# EasyEDA Pro project ProPrj_农装B类小车V2_2025-10-25.epro, board PCB7_1
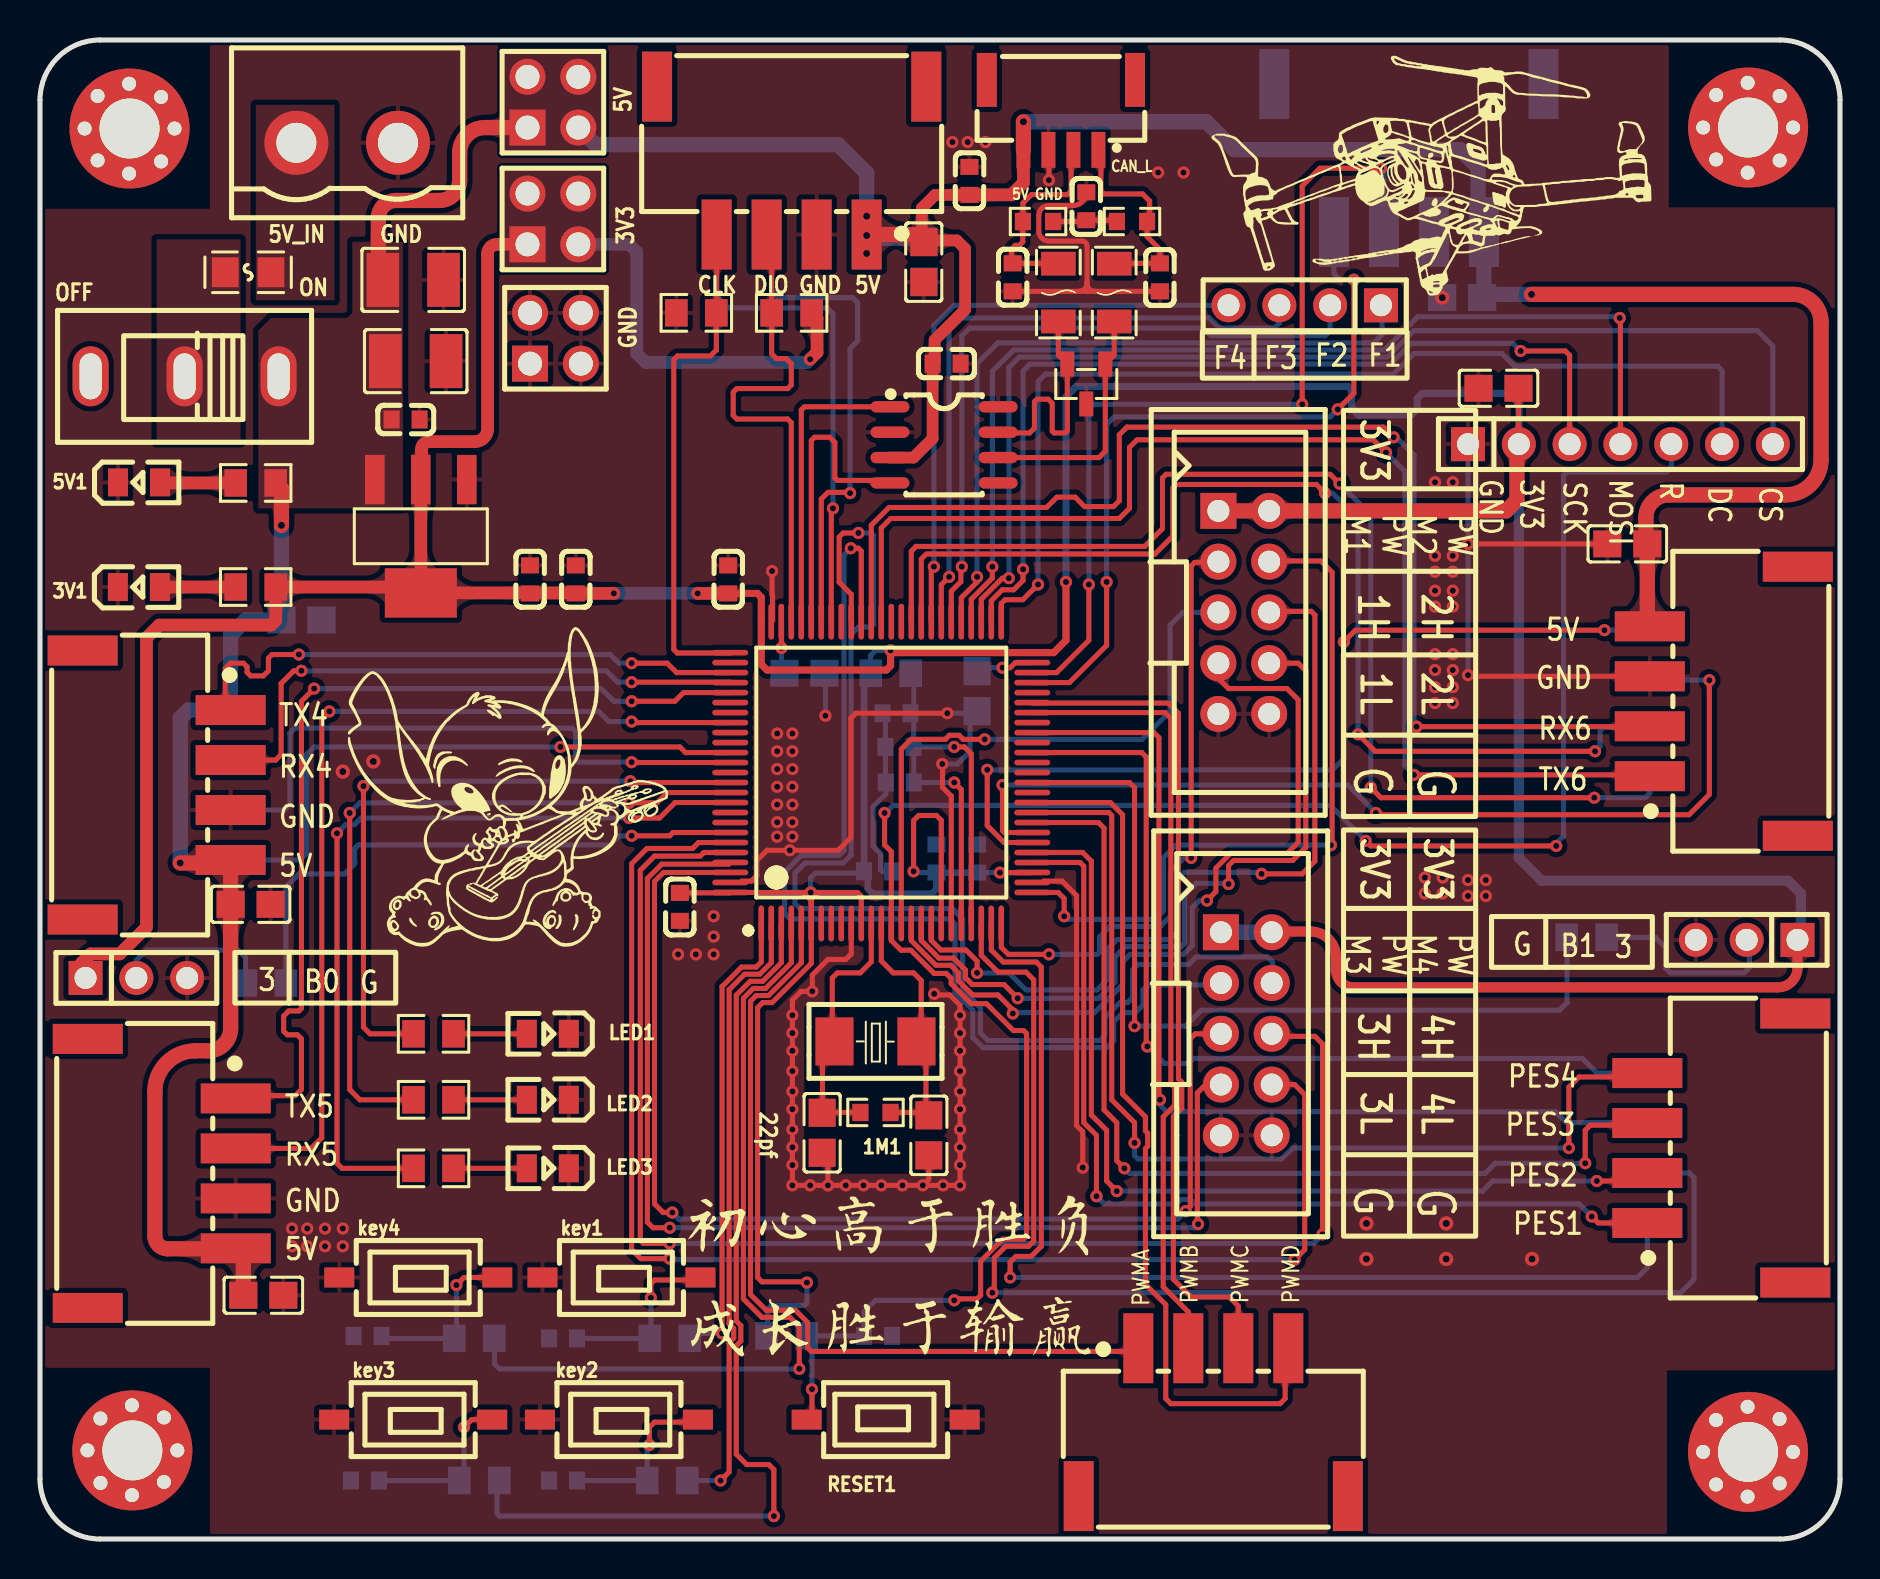
[diagram p8: board, top side]
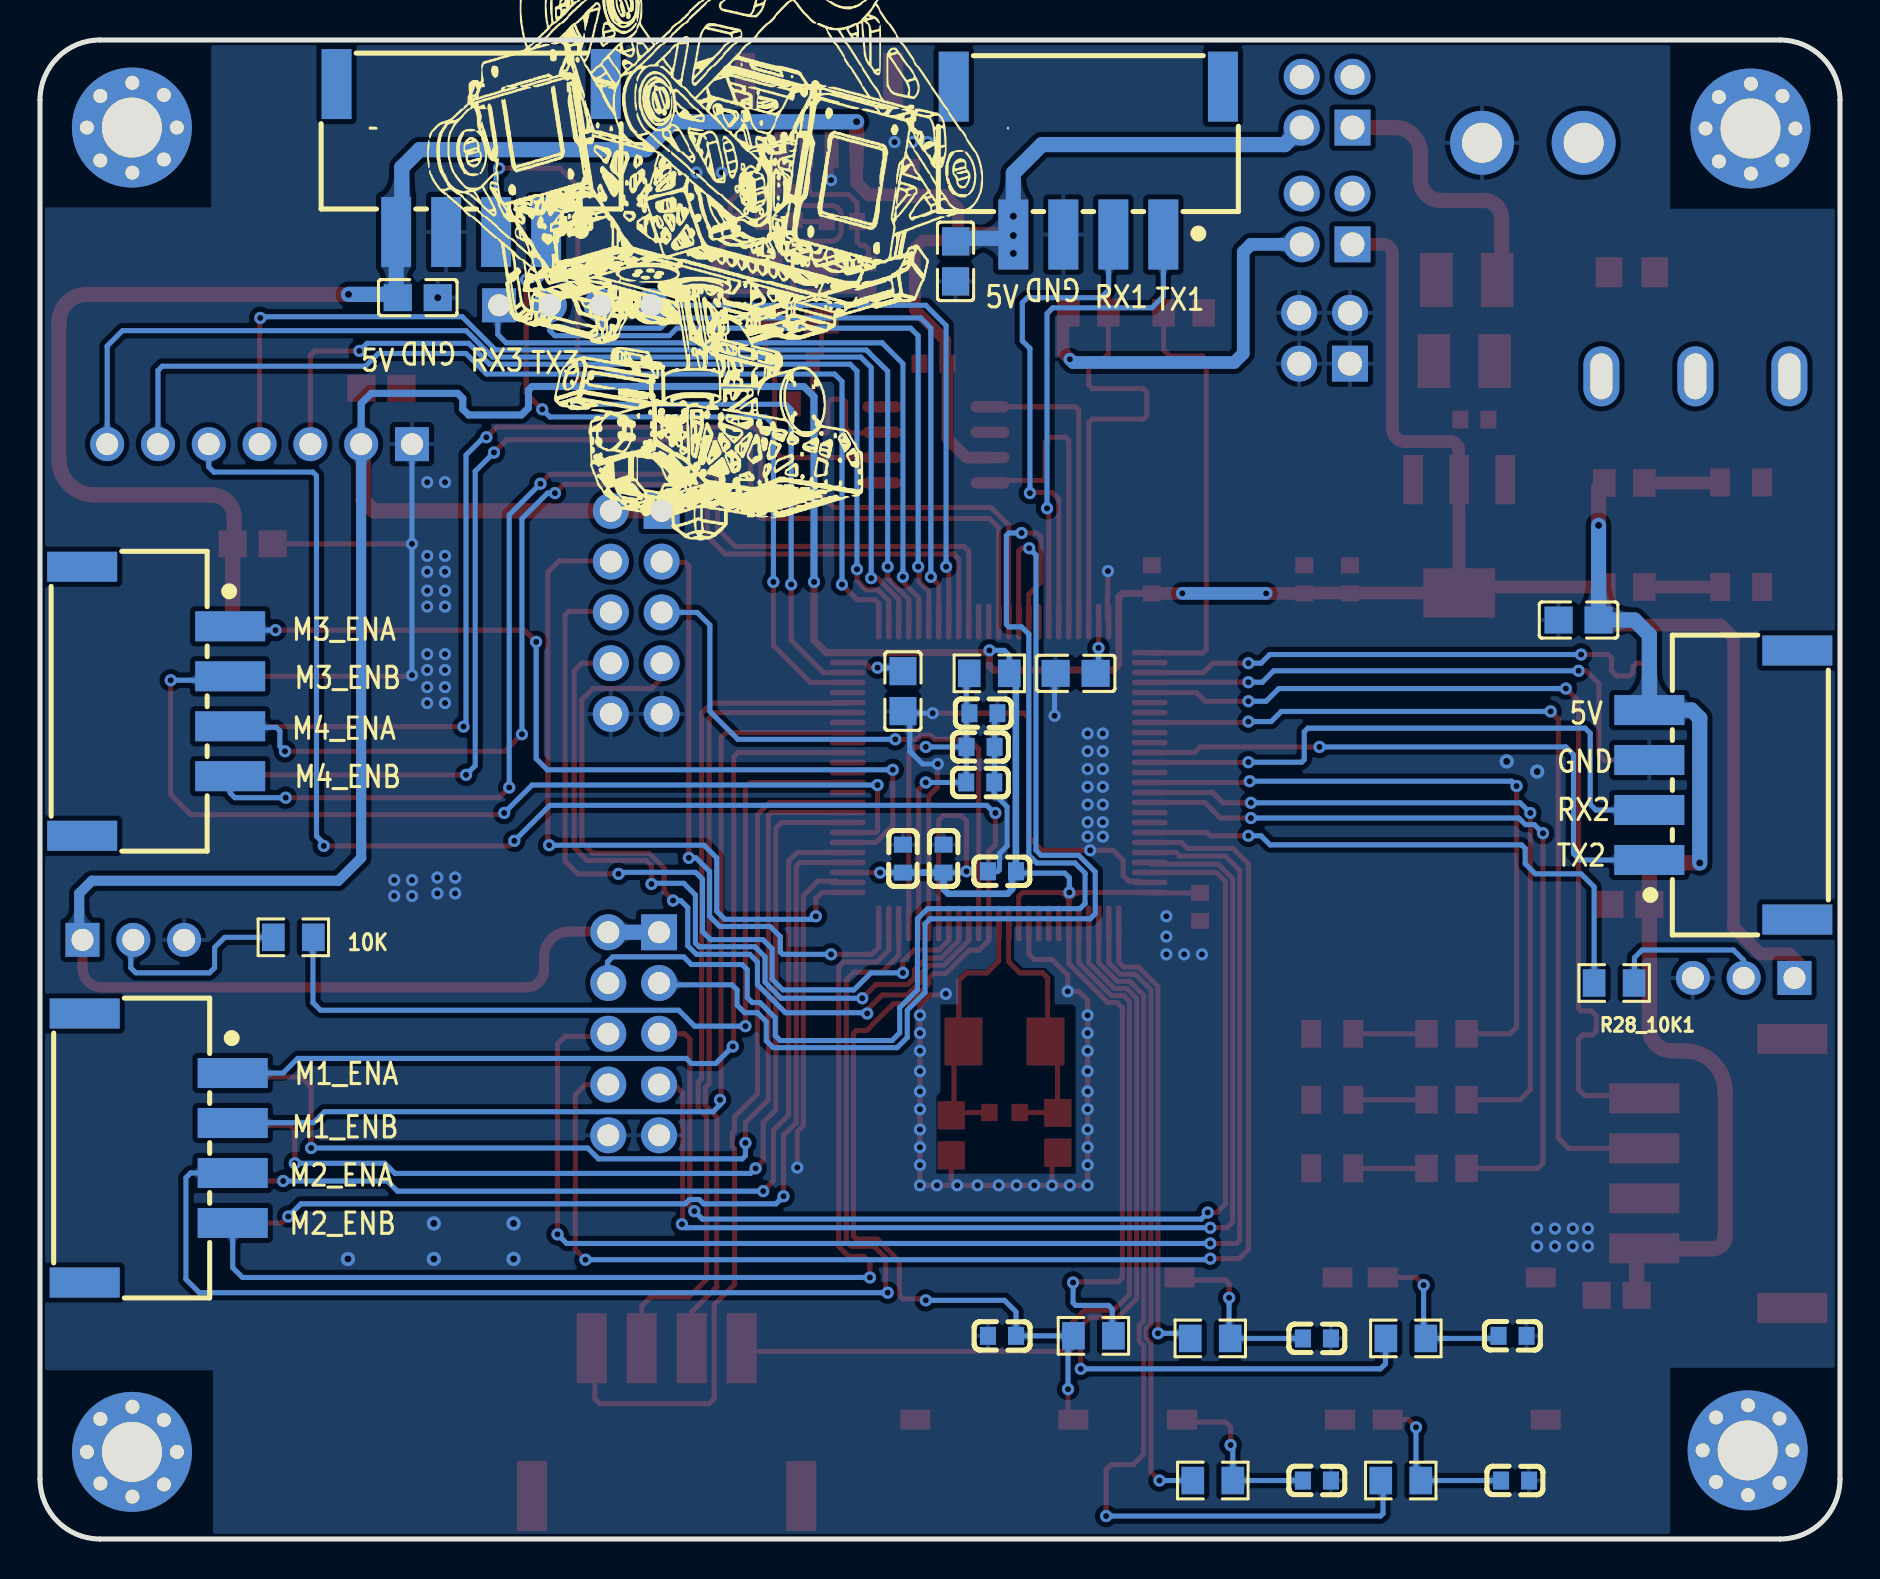
[diagram p9: board, bottom side, seen from below]

Outline 90 x 75 mm; copper layers: Top Layer, Bottom Layer. Coordinates in mm from the lower left corner of the outline.
Outline path: 0,72 arc(0.88,74.12) 3,75 87,75 arc(89.12,74.12) 90,72 90,3 arc(89.12,0.88) 87,0 3,0 arc(0.88,0.88) 0,3 0,72
Stack: Top Layer 0.035mm / Dielectric1 1.51mm FR4 er 4.5 / Bottom Layer 0.035mm

## Design rules (mm)
net OSC_OUT: DP1
net OSC_IN: DP1
net CAN1_L: DP4
net CAN1_H: DP4
net USART2_TX: DP7
net USART2_RX: DP7
net USART1_TX: DP6
net USART1_RX: DP6
net USART4_TX: DP8
net USART4_RX: DP8
net SWDIO: DP3
net SWCLK: DP3
net USART5_TX: DP9
net USART5_RX: DP9
net USART6_TX: DP10
net USART6_RX: DP10
net $1N59236: DP5
net $1N59237: DP5
net CAN1_RX: DP2
net CAN1_TX: DP2
template: 自定义配置
spacing copperThickness1oz (default): track to track 0.102, other pairs 0.152 to 0.3
spacing copperThickness2oz: track to track 0.203, other pairs 0.152 to 0.3
track width copperThickness1oz (default): min 0.127, default 0.254, max 2.54
track width copperThickness2oz: min 0.203, default 0.254, max 2.54
differential pair differentialPair (default): width min 0.127, default 0.254, max 2.54; gap min 0.152, default 0.152
via viaSize (default): diameter min 0.5, default 0.61, max 10; hole min 0.3, default 0.305, max 6.299
net $1N12322 uses copperRegion1

## Placement (name value [footprint] x y rotation side)
1M1  SCR0603J1K  [R0603]  41.77 21.34 0 top
3V1  NCD0805R1  [LED0805-R-RD]  4.94 47.63 0 top
5V1  NCD0805R1  [LED0805-R-RD]  4.95 52.86 0 top
C1  104  [C0603]  26.15 10.04 180 bottom
C1_22pf1  22pf  [C0805]  44.44 20.2 90 top
C2_22pf1  100nF  [C0805]  39.11 20.32 90 top
C5  104  [C0603]  46.85 34.04 270 bottom
C6  104  [C0603]  44.82 34.04 270 bottom
C7  104  [C0603]  32 31.63 90 top
C8  104  [C0603]  34.41 48.01 270 top
C9  104  [C0603]  41.9 33.41 180 bottom
C10  106  [C0603]  26.79 48.01 270 top
C22  104  [C0603]  45.33 58.81 0 top
C24  104  [C0805]  44.22 63.92 90 bottom
C25  104  [C0805]  72.93 57.57 0 top
C26  22p  [C0603]  56 63.12 90 top
C27  22p  [C0603]  52.31 66.68 90 top
C33_2.2uf1  100nF  [C0603]  42.99 37.85 0 bottom
C34_106  106  [C0603]  42.97 39.63 180 bottom
C35_104  104  [C0603]  42.83 41.32 180 bottom
C39  104  [C0603]  41.9 10.16 0 bottom
C40  104  [C0805]  44.19 63.89 270 top
C41  104  [C0805]  13.07 45.98 180 bottom
C42  104  [C0805]  71.11 62.11 0 bottom
C43  104  [C0805]  10.53 31.75 180 top
C44  2.2uf  [C0805]  46.85 42.42 270 bottom
C45  2.2uf  [C0805]  38.22 43.31 0 bottom
C52  104  [C0603]  18.28 56.01 180 top
C53  104  [C0603]  24.5 48.01 270 top
C54  100uF  [C1210]  18.66 63 0 top
C55  100uF  [C1210]  18.79 58.93 0 top
C56  104  [C0603]  26.15 2.93 180 bottom
C57  104  [C0603]  16.25 2.93 180 bottom
C58  104  [C0603]  16.37 10.16 180 bottom
C61  104  [C0805]  11.17 12.2 180 top
C63  104  [C0805]  79.37 49.79 0 top
C64  22p  [C0603]  48.63 63.12 270 top
C65  104  [C0603]  46.47 67.95 270 top
CN2  WAFER-XH2.54-4PWB  [CONN-TH_4P-P0.20_XUNPU_WAFER-XH2.54-4PWB]  5.83 37.72 90 bottom
CN3  WAFER-XH2.54-4PWB  [CONN-TH_4P-P0.20_XUNPU_WAFER-XH2.54-4PWB]  37.58 68.97 0 bottom
CN4  WAFER-XH2.54-4PWB  [CONN-TH_4P-P0.20_XUNPU_WAFER-XH2.54-4PWB]  68.44 69.09 0 bottom
CN5  WAFER-XH2.54-4PWB  [CONN-TH_4P-P0.20_XUNPU_WAFER-XH2.54-4PWB]  5.83 37.72 270 top
CN6  WAFER-XH2.54-4PWB  [CONN-TH_4P-P0.20_XUNPU_WAFER-XH2.54-4PWB]  37.58 68.97 180 top
CN15  WAFER-XH2.54-4PWB  [CONN-TH_4P-P0.20_XUNPU_WAFER-XH2.54-4PWB]  84.06 19.56 90 top
CN16  WAFER-XH2.54-4PWB  [CONN-TH_4P-P0.20_XUNPU_WAFER-XH2.54-4PWB]  58.66 5.85 0 top
CN24  DB2EVC-5.08-2P-GN  [CONN-TH_2P-P5.08_DB2EVC-5.08-2P]  15.36 69.85 180 top
CN25  WAFER-XH2.54-4PWB  [CONN-TH_4P-P0.20_XUNPU_WAFER-XH2.54-4PWB]  6.09 18.29 270 top
CN26  BH254V-10P  [IDC-TH_10P-P2.54-V-R2-C5-S2.54]  60.19 46.36 270 top
CN28  BH254V-10P  [IDC-TH_10P-P2.54-V-R2-C5-S2.54]  60.32 25.28 270 top
CN29  WAFER-XH2.54-4PWB  [CONN-TH_4P-P0.20_XUNPU_WAFER-XH2.54-4PWB]  84.19 41.91 90 top
CN30  WAFER-XH2.54-4PWB  [CONN-TH_4P-P0.20_XUNPU_WAFER-XH2.54-4PWB]  84.06 19.56 270 bottom
CN31  WAFER-XH2.54-4PWB  [CONN-TH_4P-P0.20_XUNPU_WAFER-XH2.54-4PWB]  84.19 41.91 270 bottom
CN32  GH125-S04DCA-00  [CONN-SMD_4P-P1.27_GH125-S04DCA-00]  51.05 71.25 180 top
D1  NUP2105LT1G-TP  [SOT-23-3_L2.9-W1.3-P1.90-LS2.4-BR]  52.31 57.79 90 top
F1  BSMD0805-100-6V  [F0805]  10.41 63.38 0 top
F3  nSMD020-30V  [F1206]  53.71 62.36 90 top
F4  nSMD020-30V  [F1206]  50.92 62.36 90 top
H7  H3  [HDR-TH_3P-P2.54-V-M]  4.82 28.07 0 top
H8  H3  [HDR-TH_3P-P2.54-V-M]  85.34 29.98 180 top
H25  PZ254V-11-07P  [HDR-TH_7P-P2.54-V-M]  79.02 54.78 0 top
H26  A2541WV-2x2P  [HDR-TH_4P-P2.54-V-R2-C2-S2.54_A2541WV-2X2P]  25.77 60.08 0 top
H27  A2541WV-2x2P  [HDR-TH_4P-P2.54-V-R2-C2-S2.54_A2541WV-2X2P]  25.64 71.89 0 top
H28  A2541WV-2x2P  [HDR-TH_4P-P2.54-V-R2-C2-S2.54_A2541WV-2X2P]  25.64 66.04 0 top
H29  PZ254V-11-04P  [HDR-TH_4P-P2.54-V-M]  63.24 61.73 180 top
key1  TS-1092S-B3D2-G  [SW-SMD_L6.1-W3.6-LS7.9]  29.07 13.09 180 top
key2  TS-1092S-B3D2-G  [SW-SMD_L6.1-W3.6-LS7.9]  28.95 5.97 180 top
key3  TS-1092S-B3D2-G  [SW-SMD_L6.1-W3.6-LS7.9]  18.66 5.97 180 top
key4  TS-1092S-B3D2-G  [SW-SMD_L6.1-W3.6-LS7.9]  18.91 13.09 180 top
LED1  NCD0805R1  [LED0805-R-RD]  25.39 25.28 180 top
LED2  NCD0805R1  [LED0805-R-RD]  25.39 21.98 180 top
LED3  NCD0805R1  [LED0805-R-RD]  25.39 18.55 180 top
NOREF  -  [Pad_e4697]  6.06 72.15 180 top
NOREF#2  -  [Pad_e4710]  85.38 72.86 0 top
NOREF#3  -  [Pad_e111]  6.2 6.08 0 top
NOREF#4  -  [Pad_e4713]  86.98 68.97 180 top
NOREF#5  -  [Pad_e4703]  6.06 68.92 180 top
NOREF#6  -  [Pad_e4705]  4.48 70.57 0 top
NOREF#7  -  [Pad_e108]  4.6 2.2 180 top
NOREF#8  -  [Pad_e105]  3.02 6.03 0 top
NOREF#9  -  [Pad_e104]  4.6 6.69 180 top
NOREF#10  -  [Pad_e109]  6.2 2.86 0 top
NOREF#11  -  [Pad_e4723]  86.98 2.78 0 top
NOREF#12  -  [Pad_e4712]  87.66 70.62 270 top
NOREF#13  -  [Pad_e4702]  4.45 68.31 0 top
NOREF#14  -  [Pad_e4717]  83.81 72.25 180 top
NOREF#15  -  [Pad_e4724]  85.38 2.12 180 top
NOREF#16  -  [Pad_e4715]  83.81 69.02 180 top
NOREF#17  -  [Pad_e4704]  6.73 70.57 270 top
NOREF#18  -  [Pad_e4701]  2.23 70.57 270 top
NOREF#19  -  [Pad_e110]  6.87 4.44 270 top
NOREF#20  -  [Pad_e4718]  85.41 70.62 0 top
NOREF#21  -  [Pad_e112]  4.62 4.44 180 top
NOREF#22  -  [Pad_e4725]  83.81 2.73 0 top
NOREF#23  -  [Pad_e107]  3.02 2.81 0 top
NOREF#24  -  [Pad_e4700]  2.88 68.97 180 top
NOREF#25  -  [Pad_e4726]  83.16 4.36 270 top
NOREF#26  -  [Pad_e4728]  85.38 6.62 180 top
NOREF#27  -  [Pad_e4714]  85.38 68.36 0 top
NOREF#28  -  [Pad_e4722]  87.65 4.36 270 top
NOREF#29  -  [Pad_e4698]  4.45 72.81 0 top
NOREF#30  -  [Pad_e4721]  86.98 6.01 0 top
NOREF#31  -  [Pad_e106]  2.37 4.44 270 top
NOREF#32  -  [Pad_e4727]  83.81 5.96 0 top
NOREF#33  -  [Pad_e4716]  83.16 70.62 270 top
NOREF#34  -  [Pad_e4711]  86.98 72.2 180 top
NOREF#35  -  [Pad_e4699]  2.88 72.2 180 top
NOREF#36  -  [Pad_e4729]  85.4 4.36 180 top
R6_1k1  1K  [R0805]  31.49 10.04 180 bottom
R7_1K1  1K  [R0805]  31.36 2.93 180 bottom
R8_1K1  1K  [R0805]  21.96 2.93 180 bottom
R10_2K1  2K  [R0805]  19.68 21.98 0 top
R10_2K2  2K  [R0805]  19.68 18.55 0 top
R10_10K1  10K  [R0805]  10.79 47.63 180 top
R10_10K2  10K  [R0805]  37.58 61.35 180 top
R10_10K3  10K  [R0805]  32.82 61.35 0 top
R13_2K1  2K  [R0805]  19.68 25.28 0 top
R13_10K1  10K  [R0805]  10.79 52.84 180 top
R19  60R4  [R0603]  49.9 65.92 180 top
R20  60R4  [R0603]  54.6 65.92 180 top
R27_0Ω1  0K  [R0805]  42.54 43.31 0 bottom
R28_10K1  10K  [R0805]  11.29 27.82 180 bottom
R29_10K1  10K  [R0805]  77.33 30.1 0 bottom
R30  10K  [R0805]  37.33 10.16 0 bottom
R31_1K1  1K  [R0805]  21.71 10.04 180 bottom
RESET1  TS-1092S-B3D2-G  [SW-SMD_L6.1-W3.6-LS7.9]  42.28 5.97 0 top
U3  单刀双掷  [SW-TH_SS-12D10-G050]  7.23 58.17 180 top
U4  -  [407vgt6]  43.68 39.88 45 top
U10  SK12D07VG3  [SOT-223-4_L6.5-W3.5-P2.30-LS7.0-BR]  19.04 50.17 90 top
U13  TJA1050T/CM,118  [SOIC-8_L5.0-W4.0-P1.27-LS6.0-BL]  45.2 54.74 270 top
X1  8MHz  [CRYSTAL-SMD_L5.0-W3.2]  41.77 24.9 0 top

## Footprints (pads in the part's own frame, mm; a bottom-side part is the same pattern mirrored in y, then rotated)
407vgt6
  oval 0.28x1.796 smd rot 135: 1(-11.809,-1.04) 2(-11.456,-1.393) 3(-11.101,-1.747) 4(-10.748,-2.1) 5(-10.394,-2.454) 6(-10.041,-2.808) 7(-9.687,-3.161) 8(-9.334,-3.514) 9(-8.98,-3.868) 10(-8.627,-4.221) 11(-8.273,-4.575) 12(-7.92,-4.929) 13(-7.566,-5.282) 14(-7.213,-5.636) 15(-6.859,-5.989) 16(-6.505,-6.343) 17(-6.152,-6.697) 18(-5.798,-7.05) 19(-5.445,-7.404) 20(-5.091,-7.757) 21(-4.737,-8.111) 22(-4.384,-8.464) 23(-4.03,-8.818) 24(-3.677,-9.171) 25(-3.323,-9.525) 51(7.354,1.152) 52(7,1.506) 53(6.646,1.859) 54(6.293,2.213) 55(5.939,2.567) 56(5.586,2.92) 57(5.232,3.273) 58(4.879,3.627) 59(4.525,3.981) 60(4.172,4.334) 61(3.818,4.688) 62(3.465,5.041) 63(3.111,5.395) 64(2.757,5.748) 65(2.404,6.102) 66(2.05,6.455) 67(1.697,6.809) 68(1.343,7.162) 69(0.99,7.516) 70(0.636,7.87) 71(0.282,8.223) 72(-0.071,8.577) 73(-0.424,8.931) 74(-0.778,9.284) 75(-1.131,9.637)
  oval 1.796x0.28 smd rot 135: 26(-1.131,-9.525) 27(-0.778,-9.171) 28(-0.424,-8.818) 29(-0.071,-8.464) 30(0.282,-8.111) 31(0.636,-7.758) 32(0.99,-7.404) 33(1.343,-7.05) 34(1.697,-6.697) 35(2.05,-6.343) 36(2.404,-5.989) 37(2.757,-5.636) 38(3.111,-5.282) 39(3.465,-4.928) 40(3.818,-4.575) 41(4.172,-4.221) 42(4.525,-3.868) 43(4.879,-3.514) 44(5.232,-3.161) 45(5.586,-2.808) 46(5.939,-2.454) 47(6.293,-2.1) 48(6.646,-1.747) 49(7,-1.393) 50(7.354,-1.04) 76(-3.324,9.637) 77(-3.677,9.284) 78(-4.03,8.931) 79(-4.384,8.577) 80(-4.737,8.223) 81(-5.091,7.87) 82(-5.445,7.516) 83(-5.798,7.162) 84(-6.152,6.809) 85(-6.505,6.455) 86(-6.859,6.102) 87(-7.213,5.748) 88(-7.566,5.395) 89(-7.92,5.042) 90(-8.273,4.688) 91(-8.627,4.334) 92(-8.98,3.981) 93(-9.334,3.627) 94(-9.688,3.273) 95(-10.041,2.92) 96(-10.395,2.567) 97(-10.748,2.213) 98(-11.101,1.859) 99(-11.456,1.506) 100(-11.809,1.152)
C0603
  rect 0.8x0.9 smd: 1(-0.7,0) 2(0.7,0)
C0805
  rect 1.41x1.35 smd: 1(-1,0) 2(1,0)
C1210
  rect 1.635x2.7 smd: 1(-1.518,0) 2(1.518,0)
CONN-SMD_4P-P1.27_GH125-S04DCA-00
  rect 0.7x1.8 smd: 1(-1.875,1.75) 2(-0.625,1.75) 3(0.625,1.75) 4(1.875,1.75)
  rect 1x2.7 smd: 5(3.705,-1.75) 6(-3.705,-1.75)
CONN-TH_2P-P5.08_DB2EVC-5.08-2P
  round 3.2 hole 2: 1(-2.54,0) 2(2.54,0)
CONN-TH_4P-P0.20_XUNPU_WAFER-XH2.54-4PWB
  rect 1.5x3.5 smd: 1(-3.75,3.7) 2(-1.25,3.7) 3(1.25,3.7) 4(3.75,3.7) 5(-6.73,-3.7) 6(6.73,-3.7)
CRYSTAL-SMD_L5.0-W3.2
  rect 1.9x2.401 smd: 1(-2.05,0) 2(2.05,0)
F0805
  rect 1.335x1.5 smd: 1(-1.143,0) 2(1.143,0)
F1206
  rect 1.19x1.728 smd: 1(-1.445,0) 2(1.445,0)
HDR-TH_3P-P2.54-V-M
  rect 1.7x1.7 hole 1.1: 1(-2.54,0)
  round 1.7 hole 1.1: 2(0,0) 3(2.54,0)
HDR-TH_4P-P2.54-V-M
  rect 1.7x1.7 hole 1.1: 1(-3.81,0)
  round 1.7 hole 1.1: 2(-1.27,0) 3(1.27,0) 4(3.81,0)
HDR-TH_4P-P2.54-V-R2-C2-S2.54_A2541WV-2X2P
  rect 1.8x1.8 hole 1.2: 1(-1.27,-1.27)
  round 1.8 hole 1.2: 2(-1.27,1.27) 3(1.27,-1.27) 4(1.27,1.27)
HDR-TH_7P-P2.54-V-M
  rect 1.7x1.7 hole 1.1: 1(-7.62,0)
  round 1.7 hole 1.1: 2(-5.08,0) 3(-2.54,0) 4(0,0) 5(2.54,0) 6(5.08,0) 7(7.62,0)
IDC-TH_10P-P2.54-V-R2-C5-S2.54
  rect 1.8x1.8 hole 1.1: 1(-5.08,-1.27)
  round 1.8 hole 1.1: 2(-5.08,1.27) 3(-2.54,-1.27) 4(-2.54,1.27) 5(0,-1.27) 6(0,1.27) 7(2.54,-1.27) 8(2.54,1.27) 9(5.08,-1.27) 10(5.08,1.27)
LED0805-R-RD
  rect 1x1.399 smd: 1(1.05,0) 2(-1.05,0)
Pad_e104
  round 1.2 hole 0.7: 1(0,0)
Pad_e105
  round 1.2 hole 0.7: 1(0,0)
Pad_e106
  round 1.2 hole 0.7: 1(0,0)
Pad_e107
  round 1.2 hole 0.7: 1(0,0)
Pad_e108
  round 1.2 hole 0.7: 1(0,0)
Pad_e109
  round 1.2 hole 0.7: 1(0,0)
Pad_e110
  round 1.2 hole 0.7: 1(0,0)
Pad_e111
  round 1.2 hole 0.7: 1(0,0)
Pad_e112
  round 6 hole 3: 1(0,0)
Pad_e4697
  round 1.2 hole 0.7: 1(0,0)
Pad_e4698
  round 1.2 hole 0.7: 1(0,0)
Pad_e4699
  round 1.2 hole 0.7: 1(0,0)
Pad_e4700
  round 1.2 hole 0.7: 1(0,0)
Pad_e4701
  round 1.2 hole 0.7: 1(0,0)
Pad_e4702
  round 1.2 hole 0.7: 1(0,0)
Pad_e4703
  round 1.2 hole 0.7: 1(0,0)
Pad_e4704
  round 1.2 hole 0.7: 1(0,0)
Pad_e4705
  round 6 hole 3: 1(0,0)
Pad_e4710
  round 1.2 hole 0.7: 1(0,0)
Pad_e4711
  round 1.2 hole 0.7: 1(0,0)
Pad_e4712
  round 1.2 hole 0.7: 1(0,0)
Pad_e4713
  round 1.2 hole 0.7: 1(0,0)
Pad_e4714
  round 1.2 hole 0.7: 1(0,0)
Pad_e4715
  round 1.2 hole 0.7: 1(0,0)
Pad_e4716
  round 1.2 hole 0.7: 1(0,0)
Pad_e4717
  round 1.2 hole 0.7: 1(0,0)
Pad_e4718
  round 6 hole 3: 1(0,0)
Pad_e4721
  round 1.2 hole 0.7: 1(0,0)
Pad_e4722
  round 1.2 hole 0.7: 1(0,0)
Pad_e4723
  round 1.2 hole 0.7: 1(0,0)
Pad_e4724
  round 1.2 hole 0.7: 1(0,0)
Pad_e4725
  round 1.2 hole 0.7: 1(0,0)
Pad_e4726
  round 1.2 hole 0.7: 1(0,0)
Pad_e4727
  round 1.2 hole 0.7: 1(0,0)
Pad_e4728
  round 1.2 hole 0.7: 1(0,0)
Pad_e4729
  round 6 hole 3: 1(0,0)
R0603
  rect 0.806x0.864 smd: 1(-0.753,0) 2(0.753,0)
R0805
  rect 1.133x1.377 smd: 1(-1,0) 2(1,0)
SOIC-8_L5.0-W4.0-P1.27-LS6.0-BL
  oval 0.569x1.95 smd: 1(-1.905,-2.705) 2(-0.635,-2.705) 3(0.635,-2.705) 4(1.905,-2.705) 5(1.905,2.705) 6(0.635,2.705) 7(-0.635,2.705) 8(-1.905,2.705)
SOT-23-3_L2.9-W1.3-P1.90-LS2.4-BR
  rect 1.25x0.7 smd: 1(1,-0.95) 2(1,0.95) 3(-1,0)
SOT-223-4_L6.5-W3.5-P2.30-LS7.0-BR
  rect 2.47x0.98 smd: 1(2.835,-2.3) 2(2.835,0) 3(2.835,2.3)
  rect 2.47x3.6 smd: 4(-2.835,0)
SW-SMD_L6.1-W3.6-LS7.9
  rect 1.5x1 smd: 1(-3.95,0) 2(3.95,0)
SW-TH_SS-12D10-G050
  oval 1.8x3 hole 1.1x2.3: 1(-4.7,0) 2(0,0) 3(4.7,0)

## Nets
GND: 3V1.2 5V1.2 C1.2 C1_22pf1.1 C2_22pf1.1 C5.1 C6.1 C7.1 C8.1 C9.1 C10.1 C22.2 C24.1 C25.1 C26.1 C27.2 C33_2.2uf1.1 C34_106.2 C35_104.2 C39.2 C40.2 C41.1 C42.1 C43.1 C44.2 C45.2 C52.1 C53.1 C54.2 C55.2 C56.2 C57.2 C58.2 C61.1 C63.1 C64.2 C65.1 CN2.3 CN3.3 CN4.3 CN5.3 CN6.2 CN24.1 CN25.3 CN26.9 CN26.10 CN28.9 CN28.10 CN29.3 CN32.3 D1.3 H7.3 H8.3 H25.1 H26.1 H26.2 H26.3 H26.4 key1.2 key2.2 key3.2 key4.2 LED1.2 LED2.2 LED3.2 R10_10K3.1 RESET1.2 U4.10 U4.20 U4.27 U4.74 U4.99 U10.1 U13.2 U13.8
VCC3V3: C5.2 C6.2 C7.2 C8.2 C9.2 C10.2 C25.2 C53.2 CN26.1 CN26.2 CN28.1 CN28.2 H7.1 H8.1 H25.2 H28.1 H28.2 H28.3 H28.4 R10_10K1.1 R10_10K2.1 R27_0Ω1.1 R30.1 U4.6 U4.11 U4.19 U4.28 U4.50 U4.75 U4.100 U10.2 U10.4
VCC5V: C22.1 C24.2 C40.1 C41.2 C42.2 C43.2 C52.2 C54.1 C55.1 C61.2 C63.2 C65.2 CN2.4 CN3.4 CN4.4 CN5.4 CN6.1 CN25.4 CN29.4 CN32.4 H27.1 H27.2 H27.3 H27.4 R13_10K1.1 U3.1 U10.3 U13.3
BOOT0: R28_10K1.1 U4.94
BOOT1: R29_10K1.1 U4.37
CAN1_H: C64.1 CN32.2 F4.2 R19.2
CAN1_L: C26.2 CN32.1 F3.2 R20.1
CAN1_RX: U4.70 U13.4
CAN1_TX: U4.71 U13.1
FREE_PIN1: H29.1 U4.55
FREE_PIN2: H29.2 U4.56
FREE_PIN3: H29.3 U4.57
FREE_PIN4: H29.4 U4.58
KEY1: R6_1k1.1 U4.1
KEY2: R7_1K1.1 U4.2
KEY3: R8_1K1.1 U4.3
KEY4: R31_1K1.1 U4.4
LED1: R13_2K1.1 U4.89
LED2: R10_2K1.1 U4.90
LED3: R10_2K2.1 U4.91
M1_ENA: CN30.1 U4.40
M1_ENB: CN30.2 U4.42
M1_H: CN26.5 U4.15
M1_L: CN26.7 U4.16
M1_PWM: CN26.3 U4.25
M2_ENA: CN30.3 U4.23
M2_ENB: CN30.4 U4.24
M2_H: CN26.6 U4.18
M2_L: CN26.8 U4.17
M2_PWM: CN26.4 U4.26
M3_ENA: CN31.1 U4.31
M3_ENB: CN31.2 U4.32
M3_H: CN28.5 U4.98
M3_L: CN28.7 U4.97
M3_PWM: CN28.3 U4.65
M4_ENA: CN31.3 U4.59
M4_ENB: CN31.4 U4.60
M4_H: CN28.6 U4.96
M4_L: CN28.8 U4.95
M4_PWM: CN28.4 U4.66
OLED_CS: H25.7 U4.53
OLED_DC: H25.6 U4.51
OLED_MOSI: H25.4 U4.54
OLED_SCK: H25.3 U4.52
OSC_IN: 1M1.1 C2_22pf1.2 U4.12 X1.1
OSC_OUT: 1M1.2 C1_22pf1.2 U4.13 X1.2
PES1: CN15.1 U4.29
PES2: CN15.2 U4.30
PES3: CN15.3 U4.33
PES4: CN15.4 U4.34
POWER5V: F1.1 U3.2
PWMA: CN16.1 U4.5
PWMB: CN16.2 U4.44
PWMC: CN16.3 U4.45
PWMD: CN16.4 U4.35
RESET: C39.1 H25.5 R30.2 RESET1.1 U4.14
SWCLK: CN6.4 R10_10K3.2 U4.76
SWDIO: CN6.3 R10_10K2.2 U4.72
USART1_RX: CN3.2 U4.69
USART1_TX: CN3.1 U4.68
USART2_RX: CN2.2 U4.87
USART2_TX: CN2.1 U4.86
USART3_RX: CN4.2 U4.48
USART3_TX: CN4.1 U4.47
USART4_RX: CN5.2 U4.79
USART4_TX: CN5.1 U4.78
USART5_RX: CN25.2 U4.83
USART5_TX: CN25.1 U4.80
USART6_RX: CN29.2 U4.64
USART6_TX: CN29.1 U4.63
$1N12245: H8.2 R29_10K1.2
$1N12257: 3V1.1 R10_10K1.2
$1N12259: C44.1 U4.49
$1N12262: C33_2.2uf1.2 C34_106.1 C35_104.1 R27_0Ω1.2 U4.21 U4.22
$1N12267: 5V1.1 R13_10K1.2
$1N12270: C45.1 U4.73
$1N12297: U4.93
$1N12307: U4.92
$1N12322: CN24.2 F1.2
$1N12352: H7.2 R28_10K1.2
$1N12469: C58.1 key4.1 R31_1K1.2
$1N12473: C56.1 key2.1 R7_1K1.2
$1N12474: C57.1 key3.1 R8_1K1.2
$1N12475: C1.1 key1.1 R6_1k1.2
$1N12476: LED1.1 R13_2K1.2
$1N12492: LED2.1 R10_2K1.2
$1N19878: U4.36
$1N19894: U4.77
$1N22147: LED3.1 R10_2K2.2
$1N26955: U4.67
$1N26969: U4.61
$1N26971: U4.62
$1N27004: U4.7
$1N32120: U4.39
$1N47198: U4.41
$1N47206: U4.43
$1N47218: U4.46
$1N59236: D1.1 F3.1 U13.6
$1N59237: D1.2 F4.1 U13.7
$1N59244: C27.1 R19.1 R20.2

Pads without a net: CN2 5 6; CN3 5 6; CN4 5 6; CN5 5 6; CN6 5 6; CN15 5 6; CN16 5 6; CN25 5 6; CN29 5 6; CN30 5 6; CN31 5 6; CN32 5 6; NOREF 1; NOREF#2 1; NOREF#3 1; NOREF#4 1; NOREF#5 1; NOREF#6 1; NOREF#7 1; NOREF#8 1; NOREF#9 1; NOREF#10 1; NOREF#11 1; NOREF#12 1; NOREF#13 1; NOREF#14 1; NOREF#15 1; NOREF#16 1; NOREF#17 1; NOREF#18 1; NOREF#19 1; NOREF#20 1; NOREF#21 1; NOREF#22 1; NOREF#23 1; NOREF#24 1; NOREF#25 1; NOREF#26 1; NOREF#27 1; NOREF#28 1; NOREF#29 1; NOREF#30 1; NOREF#31 1; NOREF#32 1; NOREF#33 1; NOREF#34 1; NOREF#35 1; NOREF#36 1; U3 3; U4 8 9 38 81 82 84 85 88; U13 5

## Via types
v1: diameter 0.61, hole 0.305, Top Layer to Bottom Layer, 208 vias
v2: diameter 0.711, hole 0.355, Top Layer to Bottom Layer, 15 vias

## Routing (per net, layer and track width the routed paths; a pad name or vN(x,y) marks a point on that pad's centre or on a via; arc(x,y) is an arc through that point)
GND: length 145.4
  Top Layer w0.254: CN29.3 71.46,43.16 v1(71.4,43.22) ; v1(50.45,67.99) 50.45,69.48 CN32.3 ; 34.51,32.85 35.03,32.85 35.1,32.91 35.57,32.91 35.84,33.19 35.84,33.95 36.35,34.46 v1(37.49,34.46) 39.91,34.46 40.54,35.09 40.54,41.06 40.79,41.32 v1(45.37,41.32) ; 52.34,62.42 52.73,62.42 ; 52.34,62.42 51.93,62.42 ; 52.34,62.42 arc(52.35,62.43) 52.35,62.44 52.35,62.8 ; 52.73,62.42 C26.1 ; 52.73,62.42 arc(52.46,62.54) 52.35,62.8 ; U4.74 36.63,45.96 36.63,47.2 36.6,47.23 v1(36.6,48.43) ; v1(39.4,17.69) v1(38.51,17.69) v1(37.62,17.69) v1(37.62,18.71) v1(37.62,19.6) 37.62,20.11 ; v1(39.4,17.69) v1(40.29,17.69) v1(41.18,17.69) v1(42.06,17.69) v1(43.12,17.69) v1(44.14,17.69) ; v1(39.4,17.69) 39.4,19.03 C2_22pf1.1 ; 52.35,62.85 52.35,64.68 arc(52.28,64.86) 52.1,64.94 50.45,64.94 arc(50.09,65.09) 49.94,65.45 49.94,66.21 arc(49.95,66.31) 49.98,66.41 arc(50.03,66.51) 50.11,66.59 arc(50.27,66.68) 50.45,66.72 51.65,66.72 arc(52.12,66.91) C27.2 ; 52.35,62.85 52.35,62.8 ; 52.35,62.85 arc(52.23,62.55) 51.93,62.42 ; v1(44.71,27.27) 44.76,27.22 45.49,27.22 46,26.71 v1(46,26.2) v1(46,25.31) v1(46,24.43) v1(46,23.41) v1(46,22.39) v1(46,21.5) v1(46,20.49) v1(46,19.6) v1(46,18.71) v1(46,17.69) v1(45.16,17.69) v1(44.14,17.69) ; U4.27 50.13,32.85 50.19,32.91 51.11,32.91 51.83,32.19 51.83,20.69 52.14,20.38 v1(52.14,18.58) ; U4.20 45.56,37.17 45.13,37.61 45.13,38.76 v1(45.11,38.78) ; v1(37.62,20.49) v1(37.62,21.5) v1(37.62,22.39) v1(37.62,23.41) v1(37.62,24.43) v1(37.62,25.31) v1(37.62,26.2) 37.62,26.97 38.05,27.4 v1(38.61,27.4) 38.61,28.21 39.4,29 40.29,29 40.56,29.28 U4.10 ; C64.2 51.93,62.42 ; v1(44.14,17.69) 44.44,18 C1_22pf1.1 ; C63.1 v1(71.4,49.79)
  Bottom Layer w0.254: 46.75,41.32 46.51,41.08 46.51,39.41 45.87,38.78 v1(45.11,38.78) ; 46.75,41.32 v1(45.37,41.32) ; 46.75,41.32 C44.2 ; v1(71.4,43.22) v1(71.4,49.79) H25.1 ; v1(39.27,41.19) 39.27,43.26 C45.2 ; C9.1 42.1,33.41 42.03,33.48 42.03,34.29 41.65,34.68 41.65,36.63 42.29,37.27 C33_2.2uf1.1 42.27,37.87 C34_106.2 42.27,41.41
  vias: v1(12.6,15.54) v1(12.6,14.65) v1(13.36,15.54) v1(13.36,14.65) v1(14.25,15.54) v1(14.25,14.65) v1(15.14,15.54) v1(15.14,14.65) v1(31.9,29.25) v1(32.79,29.25) v1(33.68,31.16) v1(33.68,30.14) v1(33.68,29.25) v1(36.86,40.3) v1(36.86,39.41) v1(36.86,38.52) v1(36.86,37.63) v1(36.86,36.74) v1(36.86,35.86) v1(36.86,35.14) v1(37.62,40.3) v1(37.62,39.41) v1(37.62,38.52) v1(37.62,37.63) v1(37.62,36.74) v1(37.62,35.86) v1(37.62,35.14) v1(45.62,69.89) v1(46.38,69.89) v1(47.27,69.89) v1(55.91,68.37) v1(57.18,68.37) v1(69.24,33.1) v1(69.24,32.3) v1(69.75,52.87) v1(69.75,49.19) v1(69.75,48.39) v1(69.75,47.45) v1(69.75,46.65) v1(69.75,44.27) v1(69.75,43.48) v1(69.75,42.62) v1(69.75,41.82) v1(70.13,33.1) v1(70.13,32.3) v1(70.64,52.87) v1(70.64,49.19) v1(70.64,48.39) v1(70.64,47.45) v1(70.64,46.65) v1(70.64,44.27) v1(70.64,43.48) v1(70.64,42.62) v1(70.64,41.82) v1(71.4,32.97) v1(71.4,32.17) v1(72.29,32.97) v1(72.29,32.17) v2(15.14,38.4) v2(16.66,38.9) v2(66.32,15.79) v2(66.32,14.01) v2(70.11,62.11) v2(70.31,15.79) v2(70.31,14.01) v2(74.6,14.01)
VCC3V3: length 320.9
  Top Layer w0.254: 37.84,32.35 37.95,32.35 arc(38.38,32.17) 38.56,31.73 ; 38.56,31.73 38.56,31.83 arc(38.72,32.2) 39.08,32.35 ; 38.56,31.73 38.56,31.72 ; 41.06,30.8 41.06,32.16 40.87,32.35 v1(38.53,32.35) ; v1(43.68,33.41) 43.68,35.95 43.93,36.2 44.82,36.2 45.06,35.96 U4.19 ; 49.61,33.35 49.61,33.34 v1(48,33.34) ; v1(38.53,32.35) 38.56,32.32 U4.6 38.56,28.8 36.6,26.84 36.13,26.84 35.88,26.58 35.88,13.08 36.1,12.87 38.31,12.87 v1(38.34,12.83) ; v1(38.53,32.35) 34.51,32.35 34.5,32.33 C7.2 ; H25.2 73.93,54.79 C25.2
  Top Layer w0.355: C8.2 35.87,47.31 36.06,47.12 U4.75 36.06,43.76 36.35,43.48 42.32,43.48 42.53,43.69 v1(42.53,44.46) 42.64,44.35 U4.50 50.68,44.35 51.3,44.96 v1(51.3,47.88)
  Top Layer w0.508: H8.1 87.88,28.58 arc(87.59,27.89) 86.9,27.6 65.69,27.6 arc(65.06,27.86) 64.8,28.49 64.8,29.12 arc(64.43,30.02) 63.53,30.39 61.62,30.39 arc(61.6,30.38) CN28.2
  Top Layer w0.635: 2.24,28.03 2.08,28.19 2.08,28.82 2.53,29.27 3.99,29.27 5.33,30.61 5.33,45.09 5.96,45.72 11.55,45.72 11.79,45.96 R10_10K1.1 18.75,47.63 U10.4 ; v1(28.69,47.31) C10.2 26.76,47.33 U10.4 ; U10.4 U10.2 arc(19.07,53.02) 19.08,53.04 19.08,54.52 arc(19.19,54.79) 19.46,54.91 21.74,54.91 arc(22.19,55.09) 22.38,55.54 22.38,64.3 arc(22.52,64.64) 22.85,64.77 H28.1 ; v1(32.88,47.31) 34.28,47.31 ; v1(38.51,59.03) 38.85,59.37 38.85,61.08 R10_10K2.1
  Top Layer w0.762: CN26.1 CN26.2 73.31,51.44 73.85,51.98 73.85,54.68 H25.2
  Bottom Layer w0.254: 41.11,33.32 C9.2 ; 41.11,33.32 41.07,33.28 ; 41.11,33.32 38.76,33.32 38.53,33.09 v1(38.53,32.35) ; v1(43.68,33.41) 43.74,33.34 C6.2 ; v1(42.53,44.46) 41.78,44.46 41.54,44.22 R27_0Ω1.1 ; C5.2 v1(48,33.34) ; v1(38.34,12.83) 38.34,11.82 38.22,11.69 36.57,11.69 36.39,11.51 36.39,10.22 R30.1
  Bottom Layer w0.33: R27_0Ω1.1 41.21,42.98 41.21,33.41 C9.2 41.39,33.21 41.39,32.52 41.63,32.28 44.59,32.28 44.82,32.52 C6.2 C5.2
  Bottom Layer w0.355: v1(51.3,47.88) 51.3,57.15 51.81,57.66 65.4,57.66 65.58,57.48 65.58,56.59 65.93,56.24 68.57,56.24 68.86,56.53 68.86,57.06 69.12,57.32 73.43,57.32 73.94,56.81 H25.2
  Bottom Layer w0.508: H25.2 73.94,34.08 75.08,32.93 87.4,32.93 88.04,32.3 88.04,30.14 H8.1
  Bottom Layer w0.635: v1(28.69,47.31) v1(32.88,47.31) ; v1(38.51,59.03) 38.34,58.86 30.29,58.86 29.84,59.31 29.84,64.39 29.46,64.77 H28.3
  Bottom Layer w0.762: CN28.1 CN28.2
VCC5V: length 188.1
  Top Layer w0.584: C40.1 44.27,64.97 45.84,64.97 46.26,64.56 46.26,61.51 44.73,59.99 44.73,58.91 C22.1 44.63,55.06 43.68,54.11 U13.3 ; C65.2 44.76,67.25 44.1,66.59 44.1,64.98
  Top Layer w0.635: CN32.4 49.17,67.85 48.57,67.25 C65.2
  Top Layer w0.762: C61.2 10.17,14.16 CN25.4 arc(9.78,14.53) 9.76,14.52 6.38,14.52 arc(5.93,14.71) 5.74,15.16 5.74,22.39 arc(6.34,23.83) 7.77,24.43 8.41,24.43 arc(9.2,24.75) 9.53,25.55 C43.2 9.53,33.97 9.38,33.82 v2(7.01,33.82) ; H27.1 22.25,70.62 arc(21.35,70.25) 20.98,69.35 20.98,67.99 arc(20.68,67.27) 19.97,66.97 17.81,66.97 arc(17.18,66.71) 16.92,66.08 16.92,63.22 arc(16.98,63.06) C54.1 ; v2(74.58,62.27) 87.66,62.27 arc(88.65,61.86) 89.05,60.87 89.05,54.02 arc(88.53,52.76) 87.28,52.24 81.43,52.24 arc(80.63,51.9) 80.29,51.1 80.29,49.86 arc(80.31,49.81) C63.2 80.37,45.79 CN29.4 ; R13_10K1.1 12.07,52.55 v2(12.07,50.71) ; CN32.4 v2(49.17,70.91) ; C40.1 44.1,64.98 43.81,65.27 CN6.1
  Bottom Layer w0.762: 72.19,62.19 72.19,65.39 71.91,65.68 71.91,68.62 71.02,69.51 59.72,69.51 58.32,70.91 v2(49.17,70.91) ; 72.19,62.19 72.28,62.27 v2(74.58,62.27) ; 72.19,62.19 C42.2 ; H27.3 27.77,69.76 39.91,69.76 41.33,68.34 v2(41.33,66.18) CN6.1 41.52,65.07 43.73,65.07 ; v2(7.01,33.82) 7.01,41.06 7.42,41.47 CN2.4 9.53,45.23 10.28,45.98 C41.2 v2(12.07,50.71)
  vias: v2(41.33,65.22) v2(41.33,64.32)
BOOT0: length 28.6
  Top Layer w0.254: v1(29.58,35.18) 31.49,35.18 31.65,35.35 34.51,35.35
  Bottom Layer w0.254: R28_10K1.1 12.29,32.63 12.95,33.28 15.23,33.28 15.74,33.79 15.74,34.55 15.92,34.73 28.49,34.73 28.95,35.18 v1(29.58,35.18)
BOOT1: length 42.5
  Top Layer w0.254: v1(54.73,25.66) 54.73,37.59 54.47,37.85 49.61,37.85
  Bottom Layer w0.254: R29_10K1.1 76.35,30.08 76.35,26.84 75.97,26.46 58.07,26.46 57.27,25.66 v1(54.73,25.66)
CAN1_H: length 10.4
  Top Layer w0.254: 51.67,69.5 51.55,69.38 51.55,67.44 51.37,67.26 49.57,67.26 49.15,66.84 49.15,65.92 49.14,65.91 49.14,64.9 48.96,64.72 48.76,64.72 48.58,64.54 48.58,63.88 C64.1 50.9,63.82 F4.2
CAN1_L: length 10.4
  Top Layer w0.254: F3.2 53.73,63.82 C26.2 56,64.52 55.35,65.16 R20.1 ; CN32.1 53.04,69.38 53.04,67.44 53.19,67.3 55.12,67.3 55.48,66.94 55.48,65.92
CAN1_RX: length 15.1
  Top Layer w0.254: U4.70 38.56,54.96 38.73,55.12 39.49,55.12 39.74,54.87 39.74,53.09 39.87,52.96 42.24,52.96 42.5,52.71
CAN1_TX: length 15.1
  Top Layer w0.254: U13.1 38.22,56.65 38.06,56.49 U4.71
FREE_PIN1: length 35.6
  Top Layer w0.254: v1(46.85,48.14) 46.85,47.88 46.06,47.09 U4.55
  Bottom Layer w0.254: H29.1 67.11,61.66 67.11,60.27 66.69,59.85 47.9,59.85 46.85,58.81 v1(46.85,48.14)
FREE_PIN2: length 34.6
  Top Layer w0.254: U4.56 45.56,47.42 46.04,47.9 46.04,48.59 v1(46.09,48.65)
  Bottom Layer w0.254: v1(46.09,48.65) 46.09,60.2 46.47,60.58 58.16,60.58 58.54,60.2 64.25,60.2 64.51,60.46 H29.2
FREE_PIN3: length 32.8
  Top Layer w0.254: v1(45.46,48.14) 45.06,47.74 U4.57
  Bottom Layer w0.254: v1(45.46,48.14) 45.46,60.58 45.97,61.09 58.47,61.09 58.96,60.6 59.03,60.6 59.05,60.58 61.71,60.58 61.97,60.84 H29.3
FREE_PIN4: length 30
  Top Layer w0.254: U4.58 44.56,48.52 v1(44.69,48.65)
  Bottom Layer w0.254: v1(44.69,48.65) 44.69,60.71 45.71,61.73 H29.4
KEY1: length 23.5
  Top Layer w0.254: U4.1 36.06,28.87 35.81,28.62 35.08,28.62 34.1,27.64 v1(34.1,10.29)
  Bottom Layer w0.254: v1(34.1,10.29) 32.74,10.29 R6_1k1.1
KEY2: length 31.2
  Top Layer w0.254: v1(34.03,2.93) 34.46,3.36 34.46,9.82 34.69,10.05 34.69,10.53 34.46,10.76 34.46,27.49 35.23,28.26 35.99,28.26 36.56,28.84 U4.2
  Bottom Layer w0.254: v1(34.03,2.93) R7_1K1.1
KEY3: length 48.2
  Top Layer w0.254: U4.3 37.06,28.83 36.14,27.9 35.51,27.9 34.81,27.21 34.81,10.91 35.04,10.68 35.04,9.9 34.81,9.67 34.81,4.24 35.33,3.72 36.44,3.72 36.69,3.47 v1(36.69,1.15)
  Bottom Layer w0.254: R8_1K1.1 22.85,2.81 22.85,1.27 22.98,1.15 v1(36.69,1.15)
KEY4: length 42.2
  Top Layer w0.254: U4.4 37.56,28.83 36.28,27.55 35.66,27.55 35.17,27.06 35.17,12.02 36.1,11.09 37.49,11.09 37.96,10.62 v1(37.96,8.51)
  Bottom Layer w0.254: v1(37.96,8.51) 22.98,8.51 22.72,8.77 22.72,10.02 R31_1K1.1
LED1: length 33.2
  Top Layer w0.254: v1(16.17,37.67) 16.17,25.61 16.5,25.28 R13_2K1.1 ; v1(29.52,37.91) 29.59,37.85 34.51,37.85
  Bottom Layer w0.254: v1(29.52,37.91) 16.41,37.91 v1(16.17,37.67)
LED2: length 36.7
  Top Layer w0.254: R10_2K1.1 15.99,21.98 15.48,22.48 v1(15.48,36.33) ; v1(29.46,36.83) 30.85,36.83 31.37,37.35 34.51,37.35
  Bottom Layer w0.254: v1(15.48,36.33) 15.99,36.83 v1(29.46,36.83)
LED3: length 40.7
  Top Layer w0.254: 34.51,36.85 31.75,36.85 30.98,36.07 v1(29.46,36.07) ; R10_2K2.1 15.1,18.55 14.85,18.8 v1(14.85,35.31)
  Bottom Layer w0.254: v1(29.46,36.07) 16.06,36.07 15.73,35.74 15.28,35.74 v1(14.85,35.31)
M1_ENA: length 46.1
  Top Layer w0.254: 49.61,39.35 55.09,39.35 55.31,39.12 55.31,24.69 v1(55.36,24.64)
  Bottom Layer w0.254: CN30.1 77.85,23.31 77.12,24.04 57.69,24.04 57.43,23.79 56.22,23.79 v1(55.36,24.64)
M1_ENB: length 49.6
  Top Layer w0.254: 49.61,40.35 55.69,40.35 55.95,40.09 55.95,22.03 v1(56,21.98)
  Bottom Layer w0.254: CN30.2 80.34,20.83 76.32,20.83 75.77,21.38 56.34,21.38 56,21.72 v1(56,21.98)
M1_H: length 30.1
  Top Layer w0.254: v1(47.24,40.01) 46.16,40.01 45.95,40.21 45.47,40.21 45.27,40.01 43.55,40.01 43.06,39.52 U4.15
  Bottom Layer w0.254: v1(47.24,40.01) 55.11,40.01 56.51,41.41 56.51,45.72 57.14,46.36 CN26.5
M1_L: length 40.4
  Top Layer w0.254: 58.92,43.82 58.92,43.06 59.43,42.55 62.35,42.55 62.91,41.99 62.91,34.86 62.36,34.31 59.53,34.31 58.79,33.57 58.79,32.39 v1(58.35,31.95) ; U4.16 43.56,29.94 44.8,28.71 45.53,28.71 45.91,28.33 45.91,27.94 46.63,27.22 47.9,27.22 48.64,26.48 v1(48.64,26.29)
  Bottom Layer w0.254: v1(58.35,31.95) 57.97,31.95 57.61,31.59 57.61,29.69 57.18,29.25 54.51,29.25 54.13,28.87 54.13,27.74 52.72,26.33 48.68,26.33 v1(48.64,26.29)
M1_PWM: length 30.6
  Top Layer w0.254: CN26.3 58.88,48.86 57.74,48.86 57.56,48.68 v1(57.56,34.08) ; U4.25 48.06,29.6 48.41,29.25 v1(50.45,29.25)
  Bottom Layer w0.254: v1(57.56,34.08) 57.2,34.08 56.52,33.4 56.52,31.16 56.01,30.65 53.49,30.65 52.99,30.14 52.99,29.38 52.86,29.25 v1(50.45,29.25)
M2_ENA: length 64.8
  Top Layer w0.254: U4.23 47.06,29.2 47.91,28.36 49.3,28.36 49.68,27.98 49.68,14.9 49.43,14.65 48.29,14.65 47.72,14.08 47.72,12.42 v1(47.62,12.32)
  Bottom Layer w0.254: v1(47.62,12.32) 82.03,12.32 82.7,13 82.7,18.08 82.47,18.31 CN30.3
M2_ENB: length 55.1
  Top Layer w0.254: v1(48.5,13.09) 48.5,13.85 48.8,14.14 49.56,14.14 50.07,14.65 50.07,28.62 49.81,28.87 48.16,28.87 47.56,29.47 U4.24
  Bottom Layer w0.254: CN30.4 80.37,13.58 79.87,13.09 v1(48.5,13.09)
M2_H: length 41.3
  Top Layer w0.254: CN26.6 61.51,46.41 63.57,46.41 63.75,46.23 63.75,33.91 63.11,33.28 v1(61.08,33.28) ; U4.18 44.56,29.95 45.04,29.47 46.3,29.47 46.85,28.91 v1(46.85,28.33)
  Bottom Layer w0.254: v1(61.08,33.28) 61,33.35 57.22,33.35 56.87,33.01 56.87,30.39 56.47,29.99 53.85,29.99 53.39,29.53 53.39,28.01 52.86,27.47 49.3,27.47 48.45,28.33 v1(46.85,28.33)
M2_L: length 38.2
  Top Layer w0.254: U4.17 44.06,29.94 44.94,29.06 45.68,29.06 46.27,28.48 46.27,28.08 46.61,27.74 48.2,27.74 v1(48.89,27.06) ; v1(59.43,32.77) 59.43,33.7 59.68,33.95 62.64,33.95 63.29,34.6 63.29,43.44 62.91,43.82 61.46,43.82
  Bottom Layer w0.254: v1(48.89,27.06) 52.94,27.06 53.75,27.86 53.75,29.12 54.26,29.63 57.05,29.63 57.23,29.81 57.23,32.23 57.81,32.81 59.39,32.81 v1(59.43,32.77)
M2_PWM: length 36.2
  Top Layer w0.254: CN26.4 61.5,48.94 64.04,48.94 64.61,48.36 64.61,34.78 v1(64.54,34.71) ; v1(51.21,31.16) 51.21,32.05 50.91,32.35 49.61,32.35
  Bottom Layer w0.254: v1(64.54,34.71) 56.8,34.71 56.16,34.08 56.16,31.41 55.76,31 51.36,31 v1(51.21,31.16)
M3_ENA: length 44.9
  Top Layer w0.254: v1(47.36,38.49) 47.36,35.69 48.21,34.85 U4.31 ; v1(65.19,44.89) 65.78,45.47 v1(78.22,45.47)
  Bottom Layer w0.254: v1(47.36,38.49) 64.63,38.49 65.19,39.04 v1(65.19,44.89) ; v1(78.22,45.47) 80.3,45.47 CN31.1
M3_ENB: length 49
  Top Layer w0.254: v1(66.79,36.33) 66.88,36.24 82.45,36.24 83.47,37.25 v1(83.47,42.97) ; 49.61,35.35 48.21,35.35 48.12,35.44 v1(48.12,37.72)
  Bottom Layer w0.254: v1(66.79,36.33) 65.4,37.72 v1(48.12,37.72) ; v1(83.47,42.97) 80.69,42.97 CN31.2
M3_H: length 57.5
  Top Layer w0.254: v1(57.28,16.4) 57.51,16.63 57.51,25.02 57.77,25.28 CN28.5 ; v1(31.61,16.34) 31.16,16.34 30.72,16.77 30.72,32.9 31.18,33.35 34.51,33.35
  Bottom Layer w0.254: v1(57.28,16.4) 56.89,16.01 31.94,16.01 v1(31.61,16.34)
M3_L: length 57.3
  Top Layer w0.254: CN28.7 58.28,22.74 57.87,22.32 57.87,15.79 v1(57.9,15.75) ; v1(31.49,15.57) 30.65,15.57 30.37,15.85 30.37,33.05 31.09,33.77 34.43,33.77 34.51,33.85
  Bottom Layer w0.254: v1(57.9,15.75) 57.72,15.57 v1(31.49,15.57)
M3_PWM: length 54.6
  Top Layer w0.254: v1(40.54,49.57) 40.92,49.57 41.06,49.43 U4.65
  Bottom Layer w0.254: 59.05,27.82 58.96,27.73 55.4,27.73 55.15,27.47 55.15,26.71 54.76,26.33 54.13,26.33 53.69,25.89 53.69,24.93 53.34,24.58 47.14,24.58 46.64,25.09 46.64,26.46 45.75,27.35 45.75,30.78 45.49,31.03 37.49,31.03 37.24,31.28 37.24,33.38 38.06,34.2 39.95,34.2 40.2,34.46 40.2,49.23 v1(40.54,49.57)
M4_ENA: length 55.3
  Top Layer w0.254: v1(64.25,52.33) 63.82,52.76 56.81,52.76 56.63,52.58 56.63,50.17 55.74,49.28 44.31,49.28 44.06,49.03 U4.59 ; v1(77.75,39.41) 66.76,39.41 v1(65.9,40.26)
  Bottom Layer w0.254: CN31.3 80.43,40.61 78.19,40.61 78.01,40.43 78.01,39.67 v1(77.75,39.41) ; v1(65.9,40.26) 65.9,51.05 64.62,52.33 v1(64.25,52.33)
M4_ENB: length 59.2
  Top Layer w0.254: v1(64.98,52.8) 64.51,53.27 56.31,53.27 56.12,53.09 56.12,50.55 55.24,49.66 43.81,49.66 43.56,49.42 U4.60 ; v1(77.72,37.09) 67.05,37.09 v1(66.54,37.6)
  Bottom Layer w0.254: v1(66.54,37.6) 66.54,51.24 v1(64.98,52.8) ; CN31.4 80.49,37.33 80.25,37.09 v1(77.72,37.09)
M4_H: length 70
  Top Layer w0.254: 34.51,34.35 33.19,34.35 33.01,34.17 30.72,34.17 30.01,33.46 30.01,14.94 30.17,14.79 v1(31.49,14.79) ; CN28.6 61.71,25.15 63.75,25.15 64.13,24.77 v1(64.13,15.24)
  Bottom Layer w0.254: v1(31.49,14.79) 63.67,14.79 v1(64.13,15.24)
M4_L: length 68.4
  Top Layer w0.254: v1(62.73,13.97) 63.24,14.48 63.24,22.23 62.73,22.74 CN28.8 ; v1(31.49,14.03) 30.04,14.03 29.58,14.48 29.58,33.79 30.34,34.55 32.63,34.55 32.93,34.85 34.51,34.85
  Bottom Layer w0.254: v1(31.49,14.03) 31.54,13.97 v1(62.73,13.97)
M4_PWM: length 61.7
  Top Layer w0.254: v1(40.92,50.33) 40.16,50.33 39.96,50.13 39.96,47.87 40.56,47.26 U4.66
  Bottom Layer w0.254: 61.59,27.82 61.62,27.85 61.62,28.87 61.37,29.12 57.81,29.12 57.43,28.74 54.89,28.74 54.64,28.49 54.64,27.09 54.38,26.84 54,26.84 53.24,26.08 53.24,25.19 52.99,24.94 47.4,24.94 47.02,25.32 47.02,26.58 46.13,27.47 46.13,31.03 45.62,31.54 38,31.54 37.75,31.79 37.75,33.32 38.25,33.82 40.16,33.82 40.56,34.22 40.56,45.27 40.92,45.63 41.56,45.63 41.68,45.76 41.68,50.21 41.56,50.33 v1(40.92,50.33)
OLED_CS: length 57.7
  Top Layer w0.254: U4.53 47.06,47.02 48.12,48.07 v1(48.44,48.07)
  Bottom Layer w0.254: H25.7 86.64,59.69 85.87,60.46 68.69,60.46 67.37,59.13 48.96,59.13 48.44,58.62 v1(48.44,48.07)
OLED_DC: length 52.1
  Top Layer w0.254: v1(49.9,47.76) 49.14,46.99 48.25,46.99 48.06,46.81 U4.51
  Bottom Layer w0.254: v1(49.9,47.76) 49.9,57.92 50.27,58.28 67.67,58.28 68.7,59.31 73.09,59.31 73.72,58.68 83.88,58.68 84.1,58.46 H25.6
OLED_MOSI: length 51.8
  Top Layer w0.254: v1(47.62,48.65) 47.62,48.07 46.56,47.02 U4.54 ; H25.4 79.02,61.06 v1(78.99,61.09)
  Bottom Layer w0.254: v1(47.62,48.65) 47.62,58.42 48.68,59.49 67.22,59.49 68.89,61.15 78.92,61.15 v1(78.99,61.09)
OLED_SCK: length 46.1
  Top Layer w0.254: U4.52 47.56,46.94 48.11,47.49 48.68,47.49 49.15,47.96 v1(49.15,48.52) ; H25.3 76.48,59.22 76.26,59.44 v1(74.03,59.44)
  Bottom Layer w0.254: v1(74.03,59.44) 73.65,59.82 68.56,59.82 67.52,58.78 49.49,58.78 49.15,58.44 v1(49.15,48.52)
OSC_IN: length 13.1
  Top Layer w0.254: 41.02,21.34 39.12,21.34 ; 39.12,21.34 C2_22pf1.2 ; 39.12,21.34 39.12,24.3 X1.1 39.62,25.01 39.62,28.07 39.87,28.33 41.01,28.33 41.56,28.88 U4.12
OSC_OUT: length 13.1
  Top Layer w0.254: U4.13 42.06,28.92 42.66,28.33 43.68,28.33 44.06,27.94 44.06,25.13 X1.2 44.3,24.42 44.3,21.34 ; 1M1.2 44.3,21.34 ; 44.3,21.34 C1_22pf1.2
PES1: length 47.7
  Top Layer w0.254: CN15.1 77.91,15.81 v1(77.59,16.13) ; v1(52.82,17.15) 52.82,20.2 52.19,20.83 52.19,33.66 52,33.85 U4.29
  Bottom Layer w0.254: v1(77.59,16.13) 76.95,16.77 57.74,16.77 57.53,16.99 57.04,16.99 56.82,16.77 53.2,16.77 v1(52.82,17.15)
PES2: length 47.1
  Top Layer w0.254: v1(53.84,17.4) 53.33,17.91 53.33,20.45 52.57,21.21 52.57,33.91 52.14,34.35 49.61,34.35 ; CN15.2 79.96,17.91 v1(77.84,17.91)
  Bottom Layer w0.254: v1(53.84,17.4) 72.13,17.4 72.63,17.91 v1(77.84,17.91)
PES3: length 49.4
  Top Layer w0.254: v1(54.22,18.55) 53.84,18.93 53.84,20.83 53.2,21.47 53.2,35.56 52.92,35.85 U4.33 ; v1(77.26,18.8) 77.26,20.45 77.51,20.71 80.26,20.71 CN15.3
  Bottom Layer w0.254: v1(54.22,18.55) 54.47,18.29 72.25,18.29 72.76,18.8 v1(77.26,18.8)
PES4: length 50.8
  Top Layer w0.254: v1(76.44,19.56) 76.44,22.61 76.95,23.12 80.17,23.12 CN15.4 ; v1(54.73,19.82) 54.73,20.83 53.59,21.98 53.59,36.2 53.44,36.35 49.61,36.35
  Bottom Layer w0.254: v1(54.73,19.82) 54.73,19.18 54.89,19.02 62.07,19.02 62.62,19.56 v1(76.44,19.56)
PWMA: length 41.4
  Top Layer w0.254: CN16.1 54.76,9.39 38.56,9.39 38.38,9.57 38.38,10.84 37.77,11.45 36.31,11.45 35.53,12.23 35.53,26.9 35.81,27.19 36.43,27.19 38.06,28.83 U4.5
PWMB: length 39.4
  Top Layer w0.254: CN16.2 57.42,11.36 56.16,12.61 56.16,21.12 56.73,21.7 56.73,22.58 56.54,22.77 56.54,41.06 56.26,41.35 49.61,41.35
PWMC: length 42
  Top Layer w0.254: 49.61,41.85 49.64,41.82 56.42,41.82 56.92,41.32 56.92,23.03 57.09,22.86 57.09,21.55 56.67,21.13 56.67,13 57.56,12.11 59.46,12.11 59.91,11.66 CN16.3
PWMD: length 43.7
  Top Layer w0.254: U4.35 53.52,36.85 54.13,36.24 54.13,22.27 55.27,21.12 55.27,20.42 55.38,20.31 55.38,19.65 55.27,19.54 55.27,12.74 56.29,11.73 56.29,7.03 56.54,6.77 62,6.77 62.26,7.03 62.26,9.39 CN16.4
RESET: length 104.5
  Top Layer w0.254: RESET1.1 38.6,6.24 v1(38.6,7.5) ; v1(66.28,34.93) 66.54,34.68 v1(75.81,34.68) ; v1(42.23,36.33) 42.23,34.73 42.56,34.39 U4.14 42.56,29.95 43.05,29.46 43.54,29.46 44.7,28.3 45.31,28.3 45.56,28.05 45.56,27.79 46.56,26.78 47.32,26.78 48.67,25.44 49.18,25.44 49.33,25.29 49.33,15.16 49.18,15 48.14,15 48.04,14.9 48.03,14.9 47.03,13.9 47.03,12.19 46.85,12.01 45.78,12.01 v1(45.71,11.94)
  Bottom Layer w0.254: H25.5 81.56,53.64 81.31,53.38 76.35,53.38 76.18,53.2 76.18,35.17 75.85,34.84 ; v1(38.6,7.5) 38.6,9.89 R30.2 C39.1 41.2,11.37 41.77,11.94 v1(45.71,11.94) ; v1(42.23,36.33) 42.28,36.33 42.66,36.71 64.51,36.71 v1(66.28,34.93)
SWCLK: length 25.5
  Top Layer w0.254: 34.51,44.35 34.5,44.33 31.87,44.33 31.69,44.51 31.69,59.01 31.87,59.19 33.52,59.19 33.82,59.48 R10_10K3.2 33.83,61.36 CN6.4
SWDIO: length 25.5
  Top Layer w0.254: CN6.3 36.58,65.02 R10_10K2.2 36.58,59.3 36.82,59.06 37.31,59.06 37.56,58.81 37.56,57.74 37.38,57.56 34.84,57.56 34.66,57.38 34.66,56.21 34.84,56.03 37.38,56.03 37.56,55.85 U4.72
USART1_RX: length 24.9
  Top Layer w0.254: U4.69 39.06,52.03 39.4,52.37 40.47,52.37 v1(40.5,52.33)
  Bottom Layer w0.254: CN3.2 36.57,65.03 36.57,62.49 36.95,62.11 40.63,62.11 40.88,61.85 40.88,59.95 40.5,59.57 v1(40.5,52.33)
USART1_TX: length 24.7
  Top Layer w0.254: U4.68 39.56,51.48 v1(39.65,51.57)
  Bottom Layer w0.254: CN3.1 33.83,62.17 34.41,61.6 39.36,61.6 39.65,61.31 v1(39.65,51.57)
USART2_RX: length 30.3
  Top Layer w0.254: 34.51,38.85 29.6,38.85 v1(29.58,38.87)
  Bottom Layer w0.254: v1(29.58,38.87) 26.91,38.87 26.79,38.99 26.79,40.39 26.61,40.57 12.74,40.57 12.49,40.32 12.49,36.76 12.2,36.47 CN2.2
USART2_TX: length 30.3
  Top Layer w0.254: 34.51,39.35 32.28,39.35 32,39.63 v1(26.03,39.63)
  Bottom Layer w0.254: CN2.1 13,33.97 13.33,34.29 13.33,39.25 13.71,39.63 v1(26.03,39.63)
USART3_RX: length 44.3
  Top Layer w0.254: v1(63.11,56.77) 63.11,67.7 64,68.58 v1(67.05,68.58) ; v1(52.44,47.76) 52.44,44.96 50.83,43.35 U4.48
  Bottom Layer w0.254: 67.19,65.39 67.19,68.44 v1(67.05,68.58) ; v1(52.44,47.76) 52.44,56.52 52.7,56.77 v1(63.11,56.77)
USART3_TX: length 37.4
  Top Layer w0.254: v1(65.69,63.01) 65.69,57.33 v1(64.89,56.52) ; 49.61,42.85 51.47,42.85 53.33,44.71 v1(53.33,47.88)
  Bottom Layer w0.254: CN4.1 64.69,63.32 65.01,63.01 v1(65.69,63.01) ; v1(53.33,47.88) 53.33,55.76 53.71,56.14 64.51,56.14 v1(64.89,56.52)
USART4_RX: length 29.2
  Top Layer w0.254: v1(13.07,43.44) 12.69,43.44 12.06,42.8 12.06,39.25 11.78,38.97 CN5.2 ; v1(29.58,42.87) 34.49,42.87 34.51,42.85
  Bottom Layer w0.254: v1(13.07,43.44) 28.31,43.44 28.88,42.87 v1(29.58,42.87)
USART4_TX: length 29.2
  Top Layer w0.254: v1(12.95,44.25) 11.6,44.25 11.42,44.07 11.42,43.44 11.17,43.18 10.53,43.18 10.35,43.36 10.35,43.64 10.17,43.82 9.52,43.82 9.26,43.57 9.26,41.74 CN5.1 ; 34.51,43.35 31.83,43.35 31.36,43.82 v1(29.58,43.82)
  Bottom Layer w0.254: v1(29.58,43.82) 28.95,43.82 28.51,44.25 v1(12.95,44.25)
USART5_RX: length 46.3
  Top Layer w0.254: 34.51,40.85 29.63,40.85 v1(29.58,40.9) ; v1(14.47,41.41) 14.09,41.03 14.09,20.07 13.56,19.54 CN25.2
  Bottom Layer w0.254: v1(29.58,40.9) 28.44,40.9 27.93,41.41 v1(14.47,41.41)
USART5_TX: length 46.4
  Top Layer w0.254: v1(29.58,41.91) 31.74,41.91 32.17,42.35 34.51,42.35 ; v1(13.71,42.55) 13.07,41.91 13.07,26.55 12.95,26.42 12.44,26.42 12.18,26.17 12.18,25.4 12.36,25.23 12.87,25.23 13.07,25.02 13.07,22.49 12.77,22.18 9.93,22.18 CN25.1
  Bottom Layer w0.254: v1(13.71,42.55) 28.06,42.55 28.69,41.91 v1(29.58,41.91)
USART6_RX: length 62.2
  Top Layer w0.254: v1(67.68,55.12) 67.17,55.63 54.35,55.63 53.97,55.25 53.97,51.95 53.67,51.65 52.23,51.65 51.75,52.13 50.84,52.13 50.33,51.61 42.45,51.61 41.56,50.72 U4.64 ; v1(68.82,40.64) 80.47,40.64 CN29.2
  Bottom Layer w0.254: v1(68.82,40.64) 68.7,40.77 68.7,54.23 67.81,55.12 v1(67.68,55.12)
USART6_TX: length 62.3
  Top Layer w0.254: v1(68.7,38.23) 80.43,38.23 CN29.1 ; U4.63 42.06,50.59 42.54,51.06 53.97,51.06 54.47,51.57 54.47,54.61 54.85,55 66.67,55 v1(67.3,54.36)
  Bottom Layer w0.254: v1(67.3,54.36) 68.24,53.42 68.24,38.69 v1(68.7,38.23)
$1N12245: length 10
  Bottom Layer w0.254: R29_10K1.2 80.76,30.1 81.27,29.6 81.27,28.58 81.53,28.33 85.21,28.33 85.46,28.58 85.46,29.85 H8.2
$1N12257: length 3.7
  Top Layer w0.635: 6.17,47.45 6.35,47.63 R10_10K1.2
$1N12259: length 2.9
  Top Layer w0.254: 49.61,43.85 48.76,43.85 48.51,43.59 v1(48.12,43.59)
  Bottom Layer w0.254: C44.1 47.03,43.59 v1(48.12,43.59)
$1N12262: length 26.2
  Top Layer w0.254: U4.21 46.06,37.5 v1(45.71,37.85) ; U4.22 46.56,39.28 46.22,39.63 v1(45.71,39.63)
  Bottom Layer w0.254: v1(45.71,37.85) C33_2.2uf1.2 43.69,39.63 ; 43.69,39.63 C34_106.1 ; 43.69,39.63 43.69,43.29 43.67,43.31 ; 43.69,39.63 v1(45.71,39.63)
$1N12267: length 3.8
  Top Layer w0.635: R13_10K1.2 6.03,52.84 5V1.1
$1N12270: length 2.6
  Top Layer w0.254: v1(37.07,44.58) 37.07,45.89 U4.73
  Bottom Layer w0.254: v1(37.07,44.58) 37.07,43.45 C45.1
$1N12352: length 8
  Bottom Layer w0.254: R28_10K1.2 10.28,27.83 10.28,29.09 9.9,29.47 5.33,29.47 4.82,28.96 H7.2
$1N12469: length 8.6
  Top Layer w0.254: v1(20.82,12.7) 21.2,13.09 key4.1
  Bottom Layer w0.254: 17.07,10.16 17.2,10.04 R31_1K1.2 20.82,10.15 v1(20.82,12.7)
$1N12473: length 8.8
  Top Layer w0.254: key2.1 32.77,5.85 30.72,5.85 30.47,5.59 v1(30.47,4.7)
  Bottom Layer w0.254: v1(30.47,4.7) 30.36,4.59 R7_1K1.2 C56.1
$1N12474: length 8.3
  Top Layer w0.254: v1(21.2,5.59) 21.58,5.97 key3.1
  Bottom Layer w0.254: v1(21.2,5.59) 21.2,3.16 R8_1K1.2 C57.1
$1N12475: length 9
  Top Layer w0.254: v1(30.55,12.07) 30.55,12.78 30.72,12.96 32.9,12.96 key1.1
  Bottom Layer w0.254: v1(30.55,12.07) 30.55,10.1 R6_1k1.2 C1.1
$1N12476: length 3.7
  Top Layer w0.254: R13_2K1.2 24.34,25.28
$1N12492: length 3.7
  Top Layer w0.254: R10_2K1.2 24.34,21.98
$1N22147: length 3.7
  Top Layer w0.254: R10_2K2.2 24.34,18.55
$1N59236: length 12.2
  Top Layer w0.254: U13.6 52.95,54.11 53.27,54.42 D1.1 53.71,59.24 F3.1
$1N59237: length 12.2
  Top Layer w0.254: F4.1 50.92,59.24 D1.2 51.37,55.44 51.26,55.34 50.7,55.34 50.61,55.43 50.61,56.83 50.41,57.03 49.84,57.03 49.72,56.91 49.72,55.58 49.48,55.34 47.95,55.34 U13.7
$1N59244: length 3.2
  Top Layer w0.254: R19.1 52.25,65.92 C27.1 53.79,65.98 R20.2

## Copper pours and planes (outline as drawn; the poured copper is in the pictures)
GND on Top Layer: -8.86,81.32 101.12,81.32 101.12,-13.55 -8.86,-13.55
GND on Bottom Layer: -10.26,81.96 95.53,81.96 95.53,-8.47 -10.26,-8.47
VCC3V3 on Top Layer: 23.11,68.58 28.19,68.58 28.19,63.5 23.11,63.5
VCC5V on Top Layer: 23.11,74.43 28.19,74.43 28.19,69.35 23.11,69.35
VCC5V on Top Layer: 10.91,64.9 18.15,64.9 18.15,51.57 10.91,51.57
POWER5V on Top Layer: 5.83,65.03 10.03,65.03 10.03,54.87 5.83,54.87
$1N12322 on Top Layer: 10.79,71.76 14.72,71.76 14.72,61.98 10.79,61.98

Small or netless copper shapes (teardrops, artwork), in the pictures only: 310 on Top Layer, 197 on Bottom Layer

## Text on the board
Bottom Silkscreen Layer: 10K | 5V | GND | RX2 | TX2 | M3_ENB | M4_ENB | M1_ENA | M3_ENA | M4_ENA | M1_ENB | M2_ENA | M2_ENB | TX1 | RX1 | TX3 | RX3
Top Silkscreen Layer: 5V | GND | CAN_L | PWMA | PWMB | PWMC | PWMD | OFF | 5V_IN | ON | 3V3 | 22pf | CLK | DIO | SCK | MOSI | R | DC | CS | 3 | B0 | G | F4 | F3 | F2 | F1 | B1 | TX4 | RX4 | RX6 | TX6 | TX5 | RX5 | PES3 | PES4 | PES2 | PES1 | PW / M1 | PW / M3 | PW / M2 | PW / M4 | 1H | 3H | 1L | 3L | 2H | 2L | 4H | 4L
